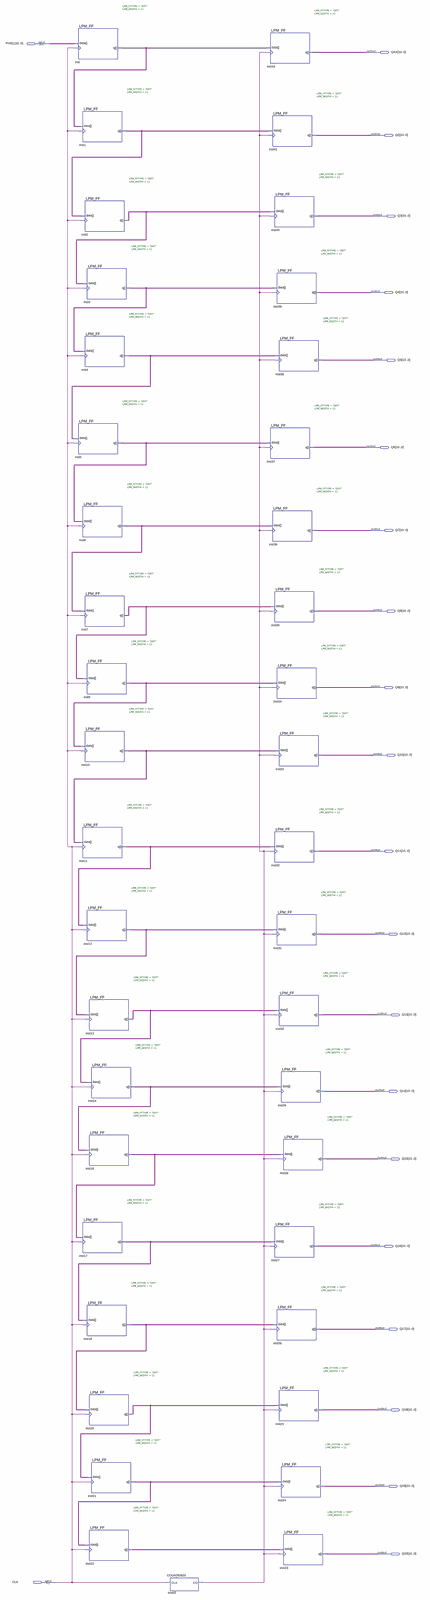
[diagram p0: schematic sheet, whole]
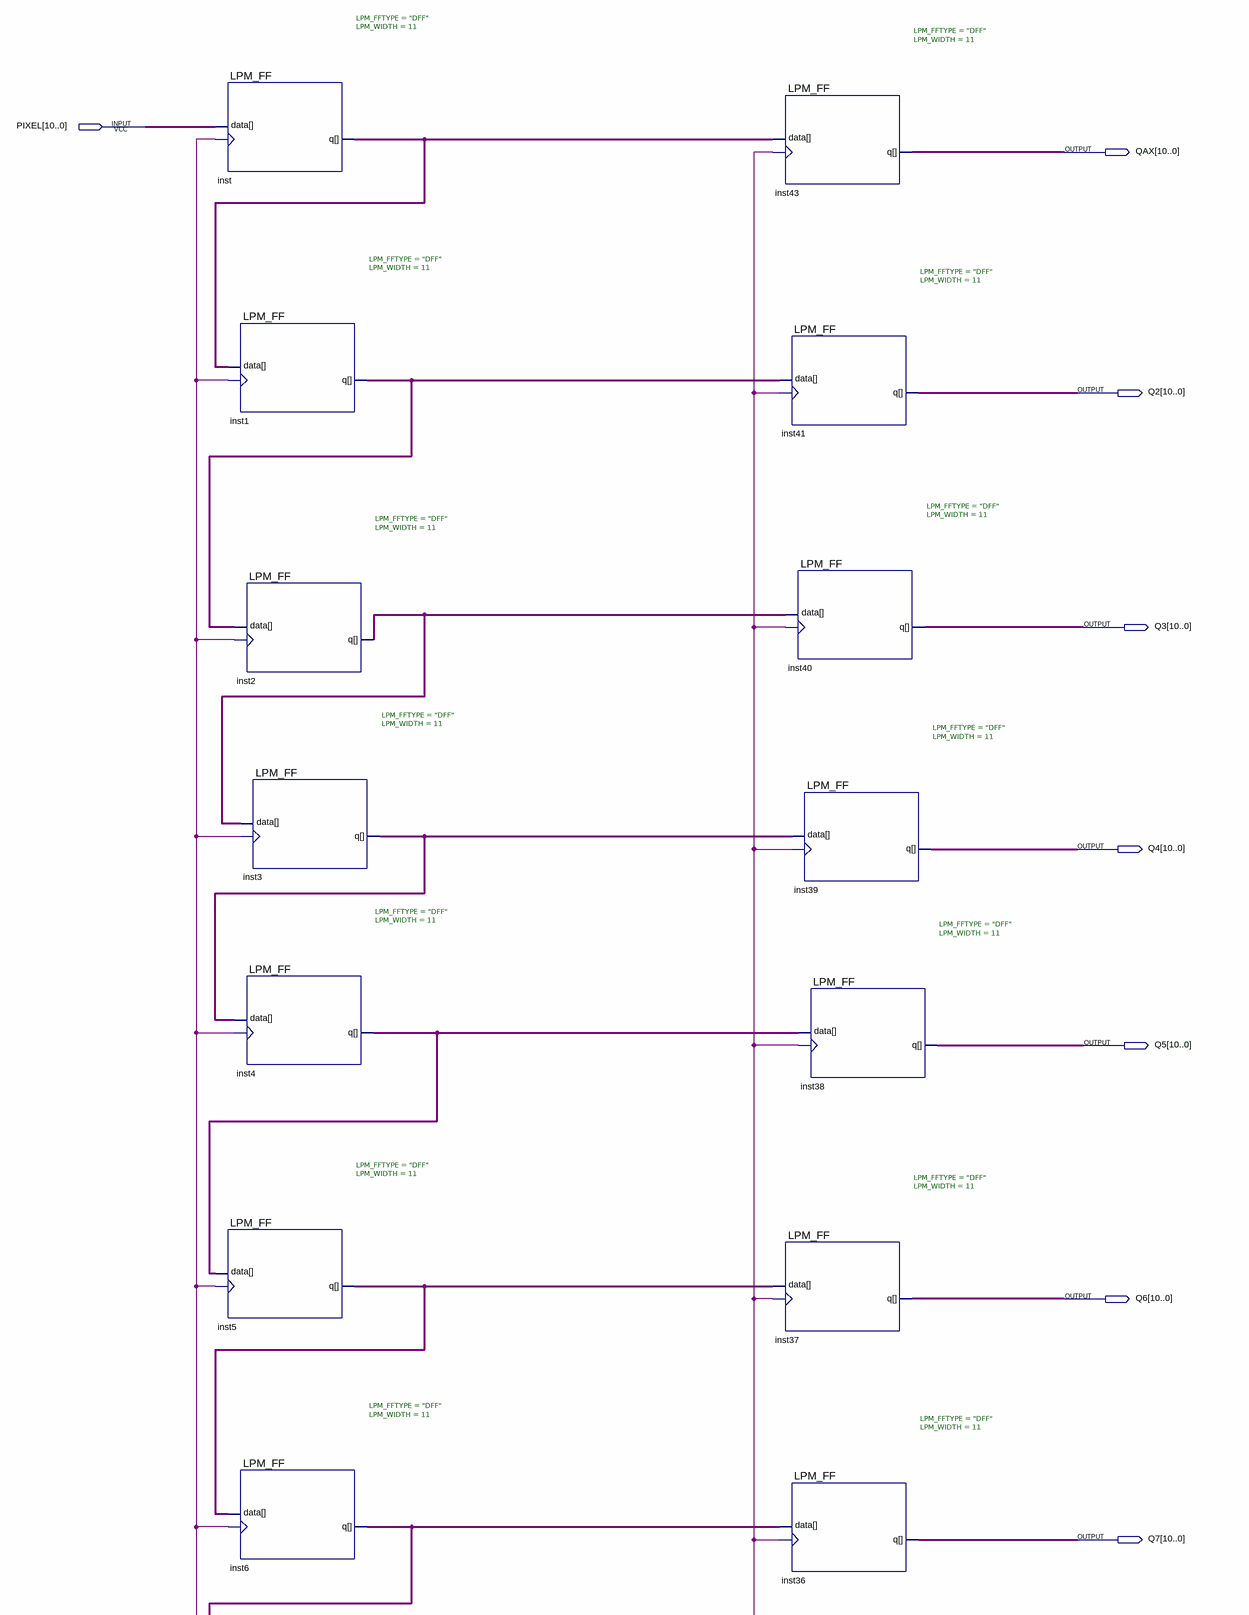
[diagram p1: schematic sheet, upper part]
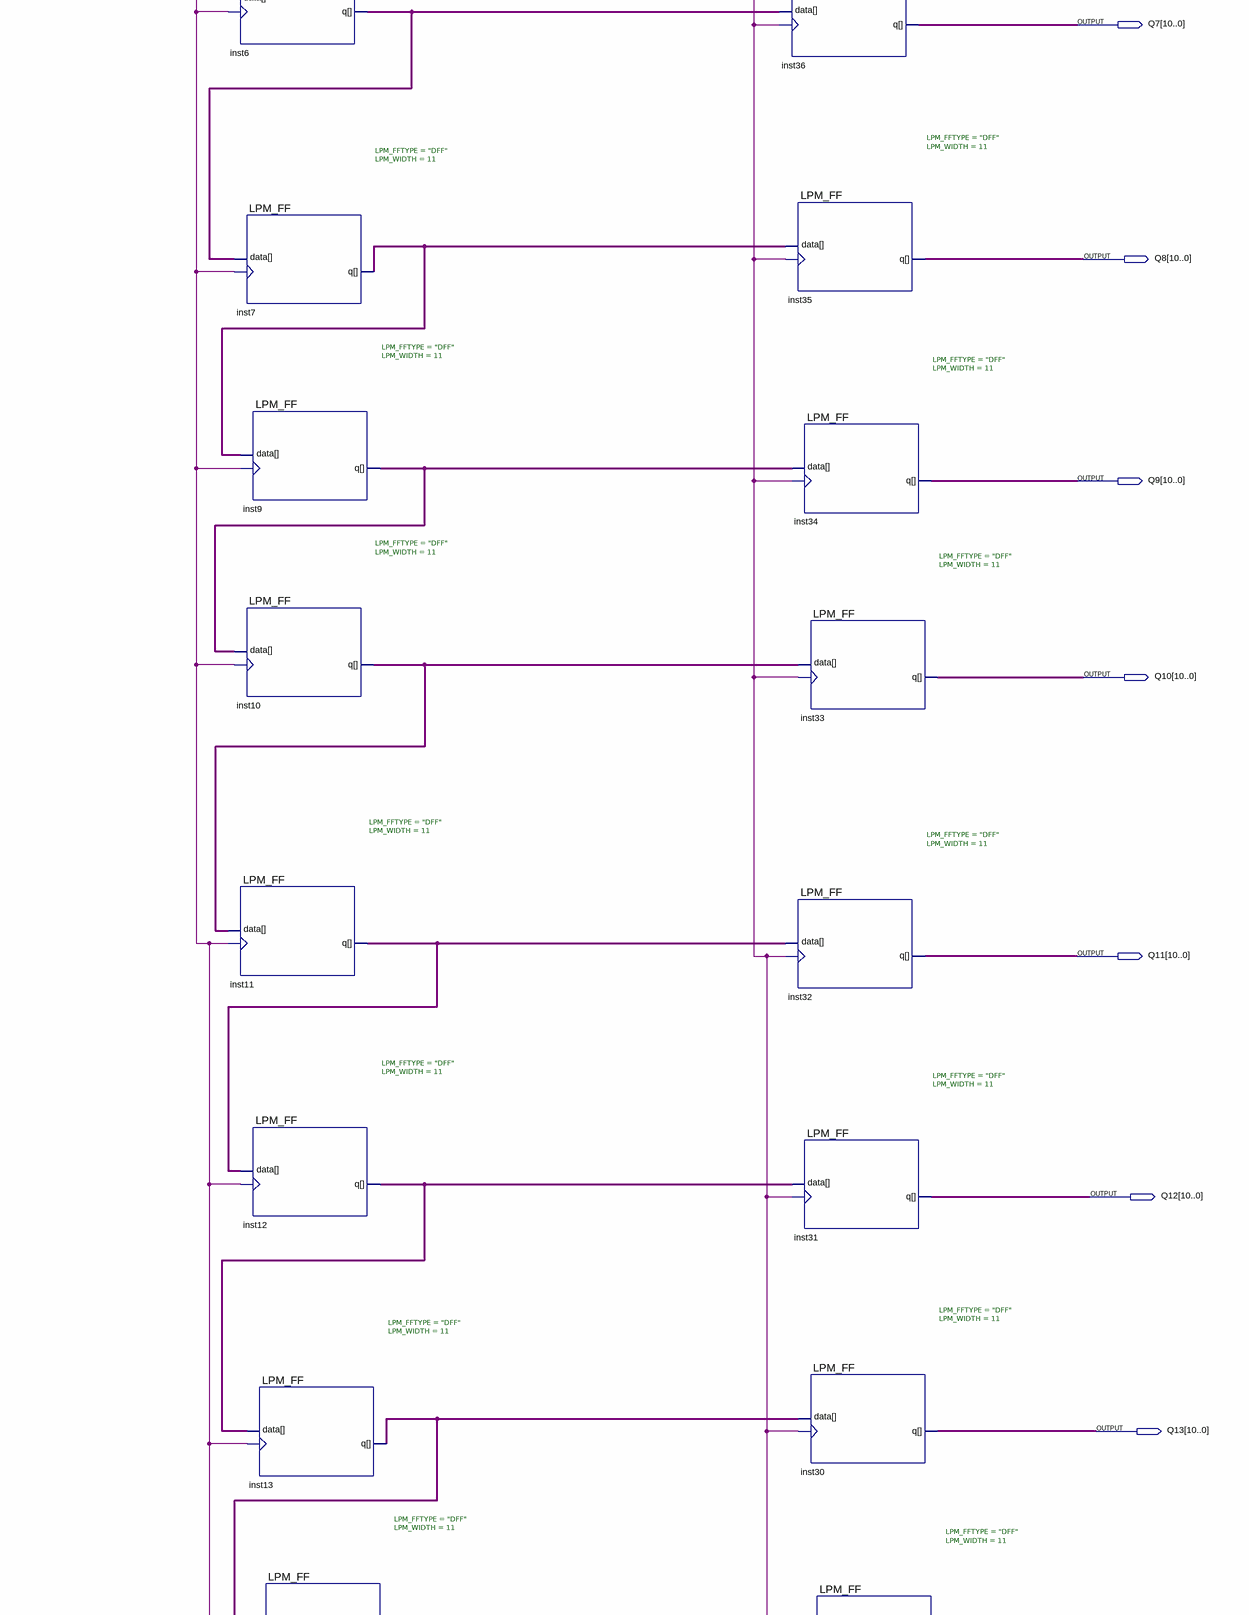
[diagram p2: schematic sheet, middle part]
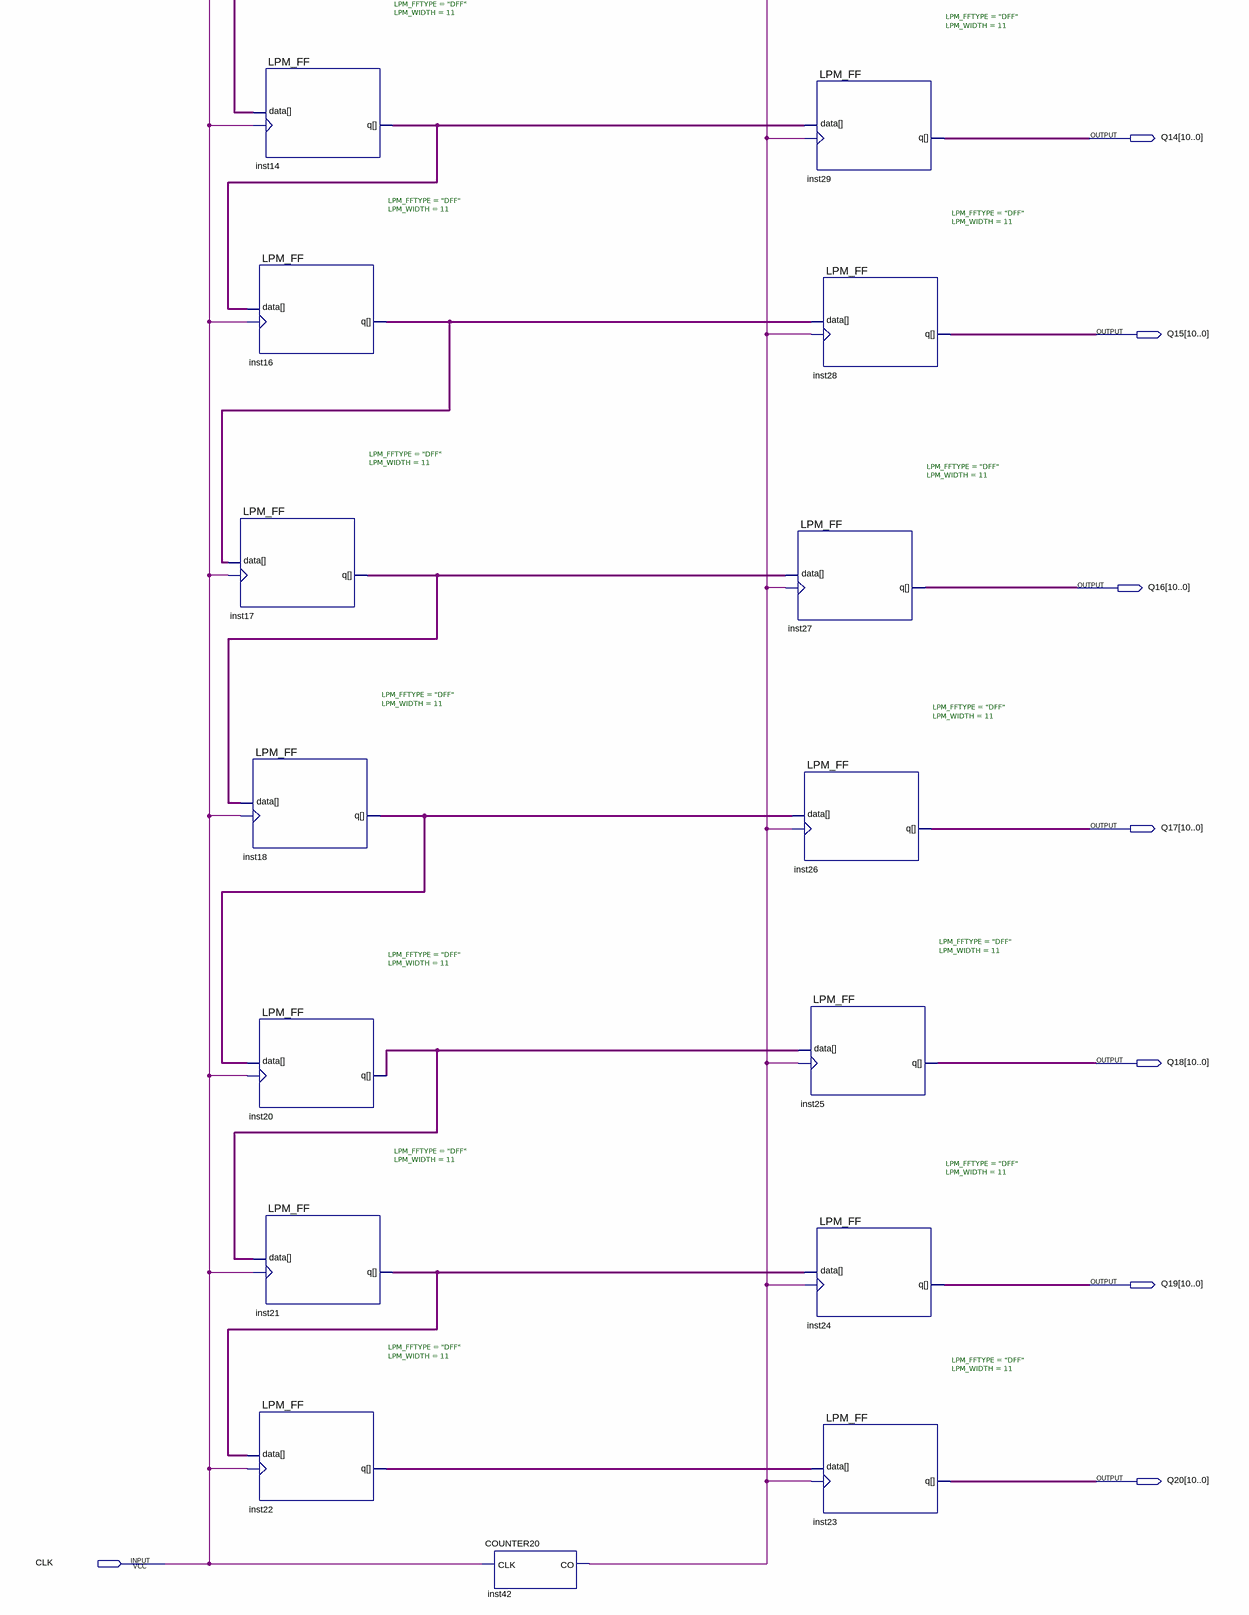
[diagram p3: schematic sheet, lower part]
// Quartus schematic SIPO20.bdf as structural Verilog: 41 symbols, 22 pins
module SIPO20 (
  input  [10:0] PIXEL,
  input  CLK,
  output [10:0] QAX,
  output [10:0] Q2,
  output [10:0] Q3,
  output [10:0] Q4,
  output [10:0] Q5,
  output [10:0] Q6,
  output [10:0] Q7,
  output [10:0] Q8,
  output [10:0] Q9,
  output [10:0] Q10,
  output [10:0] Q11,
  output [10:0] Q12,
  output [10:0] Q13,
  output [10:0] Q14,
  output [10:0] Q15,
  output [10:0] Q16,
  output [10:0] Q17,
  output [10:0] Q18,
  output [10:0] Q19,
  output [10:0] Q20
);

  wire inst42_co;
  wire [10:0] inst1_q, inst2_q, inst3_q, inst4_q, inst5_q, inst6_q, inst7_q, inst9_q, inst10_q, inst11_q,
       inst12_q, inst13_q, inst14_q, inst16_q, inst17_q, inst18_q, inst20_q, inst21_q, inst22_q, inst_q;

  LPM_FF #(.LPM_FFTYPE("DFF"), .LPM_WIDTH(11)) inst (.clock(CLK), .data(PIXEL), .q(inst_q));
  LPM_FF #(.LPM_FFTYPE("DFF"), .LPM_WIDTH(11)) inst5 (.clock(CLK), .data(inst4_q), .q(inst5_q));
  LPM_FF #(.LPM_FFTYPE("DFF"), .LPM_WIDTH(11)) inst1 (.clock(CLK), .data(inst_q), .q(inst1_q));
  LPM_FF #(.LPM_FFTYPE("DFF"), .LPM_WIDTH(11)) inst2 (.clock(CLK), .data(inst1_q), .q(inst2_q));
  LPM_FF #(.LPM_FFTYPE("DFF"), .LPM_WIDTH(11)) inst3 (.clock(CLK), .data(inst2_q), .q(inst3_q));
  LPM_FF #(.LPM_FFTYPE("DFF"), .LPM_WIDTH(11)) inst4 (.clock(CLK), .data(inst3_q), .q(inst4_q));
  LPM_FF #(.LPM_FFTYPE("DFF"), .LPM_WIDTH(11)) inst6 (.clock(CLK), .data(inst5_q), .q(inst6_q));
  LPM_FF #(.LPM_FFTYPE("DFF"), .LPM_WIDTH(11)) inst7 (.clock(CLK), .data(inst6_q), .q(inst7_q));
  LPM_FF #(.LPM_FFTYPE("DFF"), .LPM_WIDTH(11)) inst9 (.clock(CLK), .data(inst7_q), .q(inst9_q));
  LPM_FF #(.LPM_FFTYPE("DFF"), .LPM_WIDTH(11)) inst10 (.clock(CLK), .data(inst9_q), .q(inst10_q));
  LPM_FF #(.LPM_FFTYPE("DFF"), .LPM_WIDTH(11)) inst11 (.clock(CLK), .data(inst10_q), .q(inst11_q));
  LPM_FF #(.LPM_FFTYPE("DFF"), .LPM_WIDTH(11)) inst12 (.clock(CLK), .data(inst11_q), .q(inst12_q));
  LPM_FF #(.LPM_FFTYPE("DFF"), .LPM_WIDTH(11)) inst13 (.clock(CLK), .data(inst12_q), .q(inst13_q));
  LPM_FF #(.LPM_FFTYPE("DFF"), .LPM_WIDTH(11)) inst14 (.clock(CLK), .data(inst13_q), .q(inst14_q));
  LPM_FF #(.LPM_FFTYPE("DFF"), .LPM_WIDTH(11)) inst16 (.clock(CLK), .data(inst14_q), .q(inst16_q));
  LPM_FF #(.LPM_FFTYPE("DFF"), .LPM_WIDTH(11)) inst17 (.clock(CLK), .data(inst16_q), .q(inst17_q));
  LPM_FF #(.LPM_FFTYPE("DFF"), .LPM_WIDTH(11)) inst18 (.clock(CLK), .data(inst17_q), .q(inst18_q));
  LPM_FF #(.LPM_FFTYPE("DFF"), .LPM_WIDTH(11)) inst20 (.clock(CLK), .data(inst18_q), .q(inst20_q));
  LPM_FF #(.LPM_FFTYPE("DFF"), .LPM_WIDTH(11)) inst21 (.clock(CLK), .data(inst20_q), .q(inst21_q));
  LPM_FF #(.LPM_FFTYPE("DFF"), .LPM_WIDTH(11)) inst22 (.clock(CLK), .data(inst21_q), .q(inst22_q));
  COUNTER20 inst42 (.CLK(CLK), .CO(inst42_co));
  LPM_FF #(.LPM_FFTYPE("DFF"), .LPM_WIDTH(11)) inst43 (.clock(inst42_co), .data(inst_q), .q(QAX));
  LPM_FF #(.LPM_FFTYPE("DFF"), .LPM_WIDTH(11)) inst37 (.clock(inst42_co), .data(inst5_q), .q(Q6));
  LPM_FF #(.LPM_FFTYPE("DFF"), .LPM_WIDTH(11)) inst41 (.clock(inst42_co), .data(inst1_q), .q(Q2));
  LPM_FF #(.LPM_FFTYPE("DFF"), .LPM_WIDTH(11)) inst40 (.clock(inst42_co), .data(inst2_q), .q(Q3));
  LPM_FF #(.LPM_FFTYPE("DFF"), .LPM_WIDTH(11)) inst39 (.clock(inst42_co), .data(inst3_q), .q(Q4));
  LPM_FF #(.LPM_FFTYPE("DFF"), .LPM_WIDTH(11)) inst38 (.clock(inst42_co), .data(inst4_q), .q(Q5));
  LPM_FF #(.LPM_FFTYPE("DFF"), .LPM_WIDTH(11)) inst36 (.clock(inst42_co), .data(inst6_q), .q(Q7));
  LPM_FF #(.LPM_FFTYPE("DFF"), .LPM_WIDTH(11)) inst35 (.clock(inst42_co), .data(inst7_q), .q(Q8));
  LPM_FF #(.LPM_FFTYPE("DFF"), .LPM_WIDTH(11)) inst34 (.clock(inst42_co), .data(inst9_q), .q(Q9));
  LPM_FF #(.LPM_FFTYPE("DFF"), .LPM_WIDTH(11)) inst33 (.clock(inst42_co), .data(inst10_q), .q(Q10));
  LPM_FF #(.LPM_FFTYPE("DFF"), .LPM_WIDTH(11)) inst32 (.clock(inst42_co), .data(inst11_q), .q(Q11));
  LPM_FF #(.LPM_FFTYPE("DFF"), .LPM_WIDTH(11)) inst31 (.clock(inst42_co), .data(inst12_q), .q(Q12));
  LPM_FF #(.LPM_FFTYPE("DFF"), .LPM_WIDTH(11)) inst30 (.clock(inst42_co), .data(inst13_q), .q(Q13));
  LPM_FF #(.LPM_FFTYPE("DFF"), .LPM_WIDTH(11)) inst29 (.clock(inst42_co), .data(inst14_q), .q(Q14));
  LPM_FF #(.LPM_FFTYPE("DFF"), .LPM_WIDTH(11)) inst28 (.clock(inst42_co), .data(inst16_q), .q(Q15));
  LPM_FF #(.LPM_FFTYPE("DFF"), .LPM_WIDTH(11)) inst27 (.clock(inst42_co), .data(inst17_q), .q(Q16));
  LPM_FF #(.LPM_FFTYPE("DFF"), .LPM_WIDTH(11)) inst26 (.clock(inst42_co), .data(inst18_q), .q(Q17));
  LPM_FF #(.LPM_FFTYPE("DFF"), .LPM_WIDTH(11)) inst25 (.clock(inst42_co), .data(inst20_q), .q(Q18));
  LPM_FF #(.LPM_FFTYPE("DFF"), .LPM_WIDTH(11)) inst24 (.clock(inst42_co), .data(inst21_q), .q(Q19));
  LPM_FF #(.LPM_FFTYPE("DFF"), .LPM_WIDTH(11)) inst23 (.clock(inst42_co), .data(inst22_q), .q(Q20));
endmodule
